# Altium schematic sheet DCDC_Regulators.SchDoc
size B; Organization: Mechanart, LLC; Address1: 397 Laurie Meadows Drive; Address2: Apt. 437; Address3: San Mateo, CA 94403
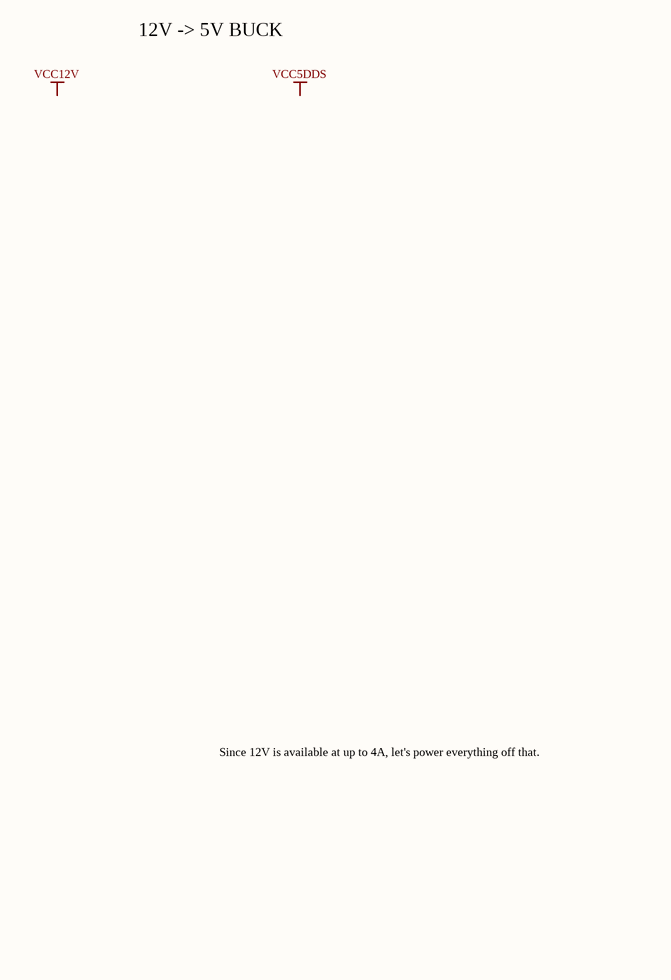
[diagram p0: DCDC_Regulators.SchDoc]

## Notes on the sheet
- 12V -> 5V BUCK
- Since 12V is available at up to 4A, let's power everything off that.
- Labels drawn without touching a wire or pin: VCC5DDS, VCC12V
- Title
- Size:
- Date:
- B
- Number:
- Time:
- Revision:
- Sheet
- of
- File: